# Altium schematic sheet fan.SchDoc
size A4; SheetNumber: 5; SheetTotal: 5
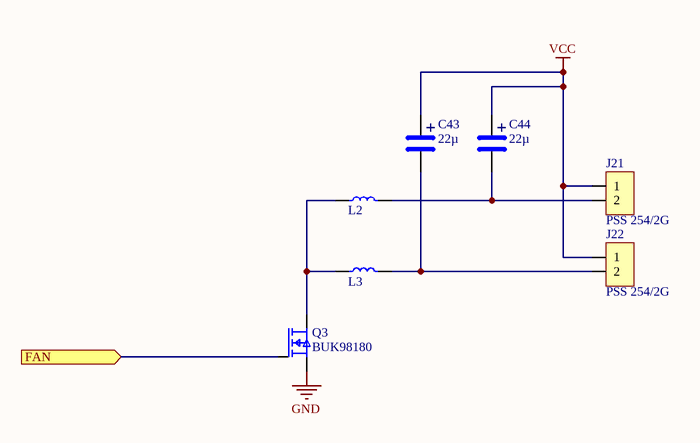
[diagram p0: fan.SchDoc]

## Parts
C43  value 22µ  [WCAP-ASLU]  (hidden comment: Elko 22µF 6.3V WE)
C44  value 22µ  [WCAP-ASLU]  (hidden comment: Elko 22µF 6.3V WE)
J21  PSS 254/2G  [PSS 2pol]
J22  PSS 254/2G  [PSS 2pol]
L2  TDL_NL322522  [NL322522]  (value not drawn)
L3  TDL_NL322522  [NL322522]  (value not drawn)
Q3  BUK98180  [SOT223]

## Ports
FAN (in)

## Nets
GND: Q3.3
VCC: C43.+ C44.+ J21.1 J22.1
FAN: Q3.1 ; port FAN
NetC43_-: C43.- J22.2 L3.2
NetC44_-: C44.- J21.2 L2.2
NetL2_1: L2.1 L3.1 Q3.2

## Library data of the parts
J21 J22 = PSS 254/2G: PSS 2pol wire-to-board-connector; reichelt code: PSS 254/2G
Q3 = BUK98180-100A: N-FET 100V 4.6A logic level; mouser code: 771-BUK98180-100ACUX; storage: AIDETEK; storageID: 186
C43 C44 = Elko 22µF 6.3V WE: voltage: 6.3V; mouser code: 710-865090168010
L2 L3 = TDL_NL322522: storage: AIDETEK; storageID: 191